# EasyEDA Pro project AT32M412_EVB_V0.3.eprj, schematic Schematic1

## Sheets
1 PWR: Board Name: AT32M412_EVB_V0.2; Create Date: 2025-06-04; Page Name: PWR; Project Name: AT32M412_EVB_V0.3; Schematic Name: Schematic1; Update Date: 2025-12-16; Company: 嘉立创EDA; Page Size: A4; Version: V1.0
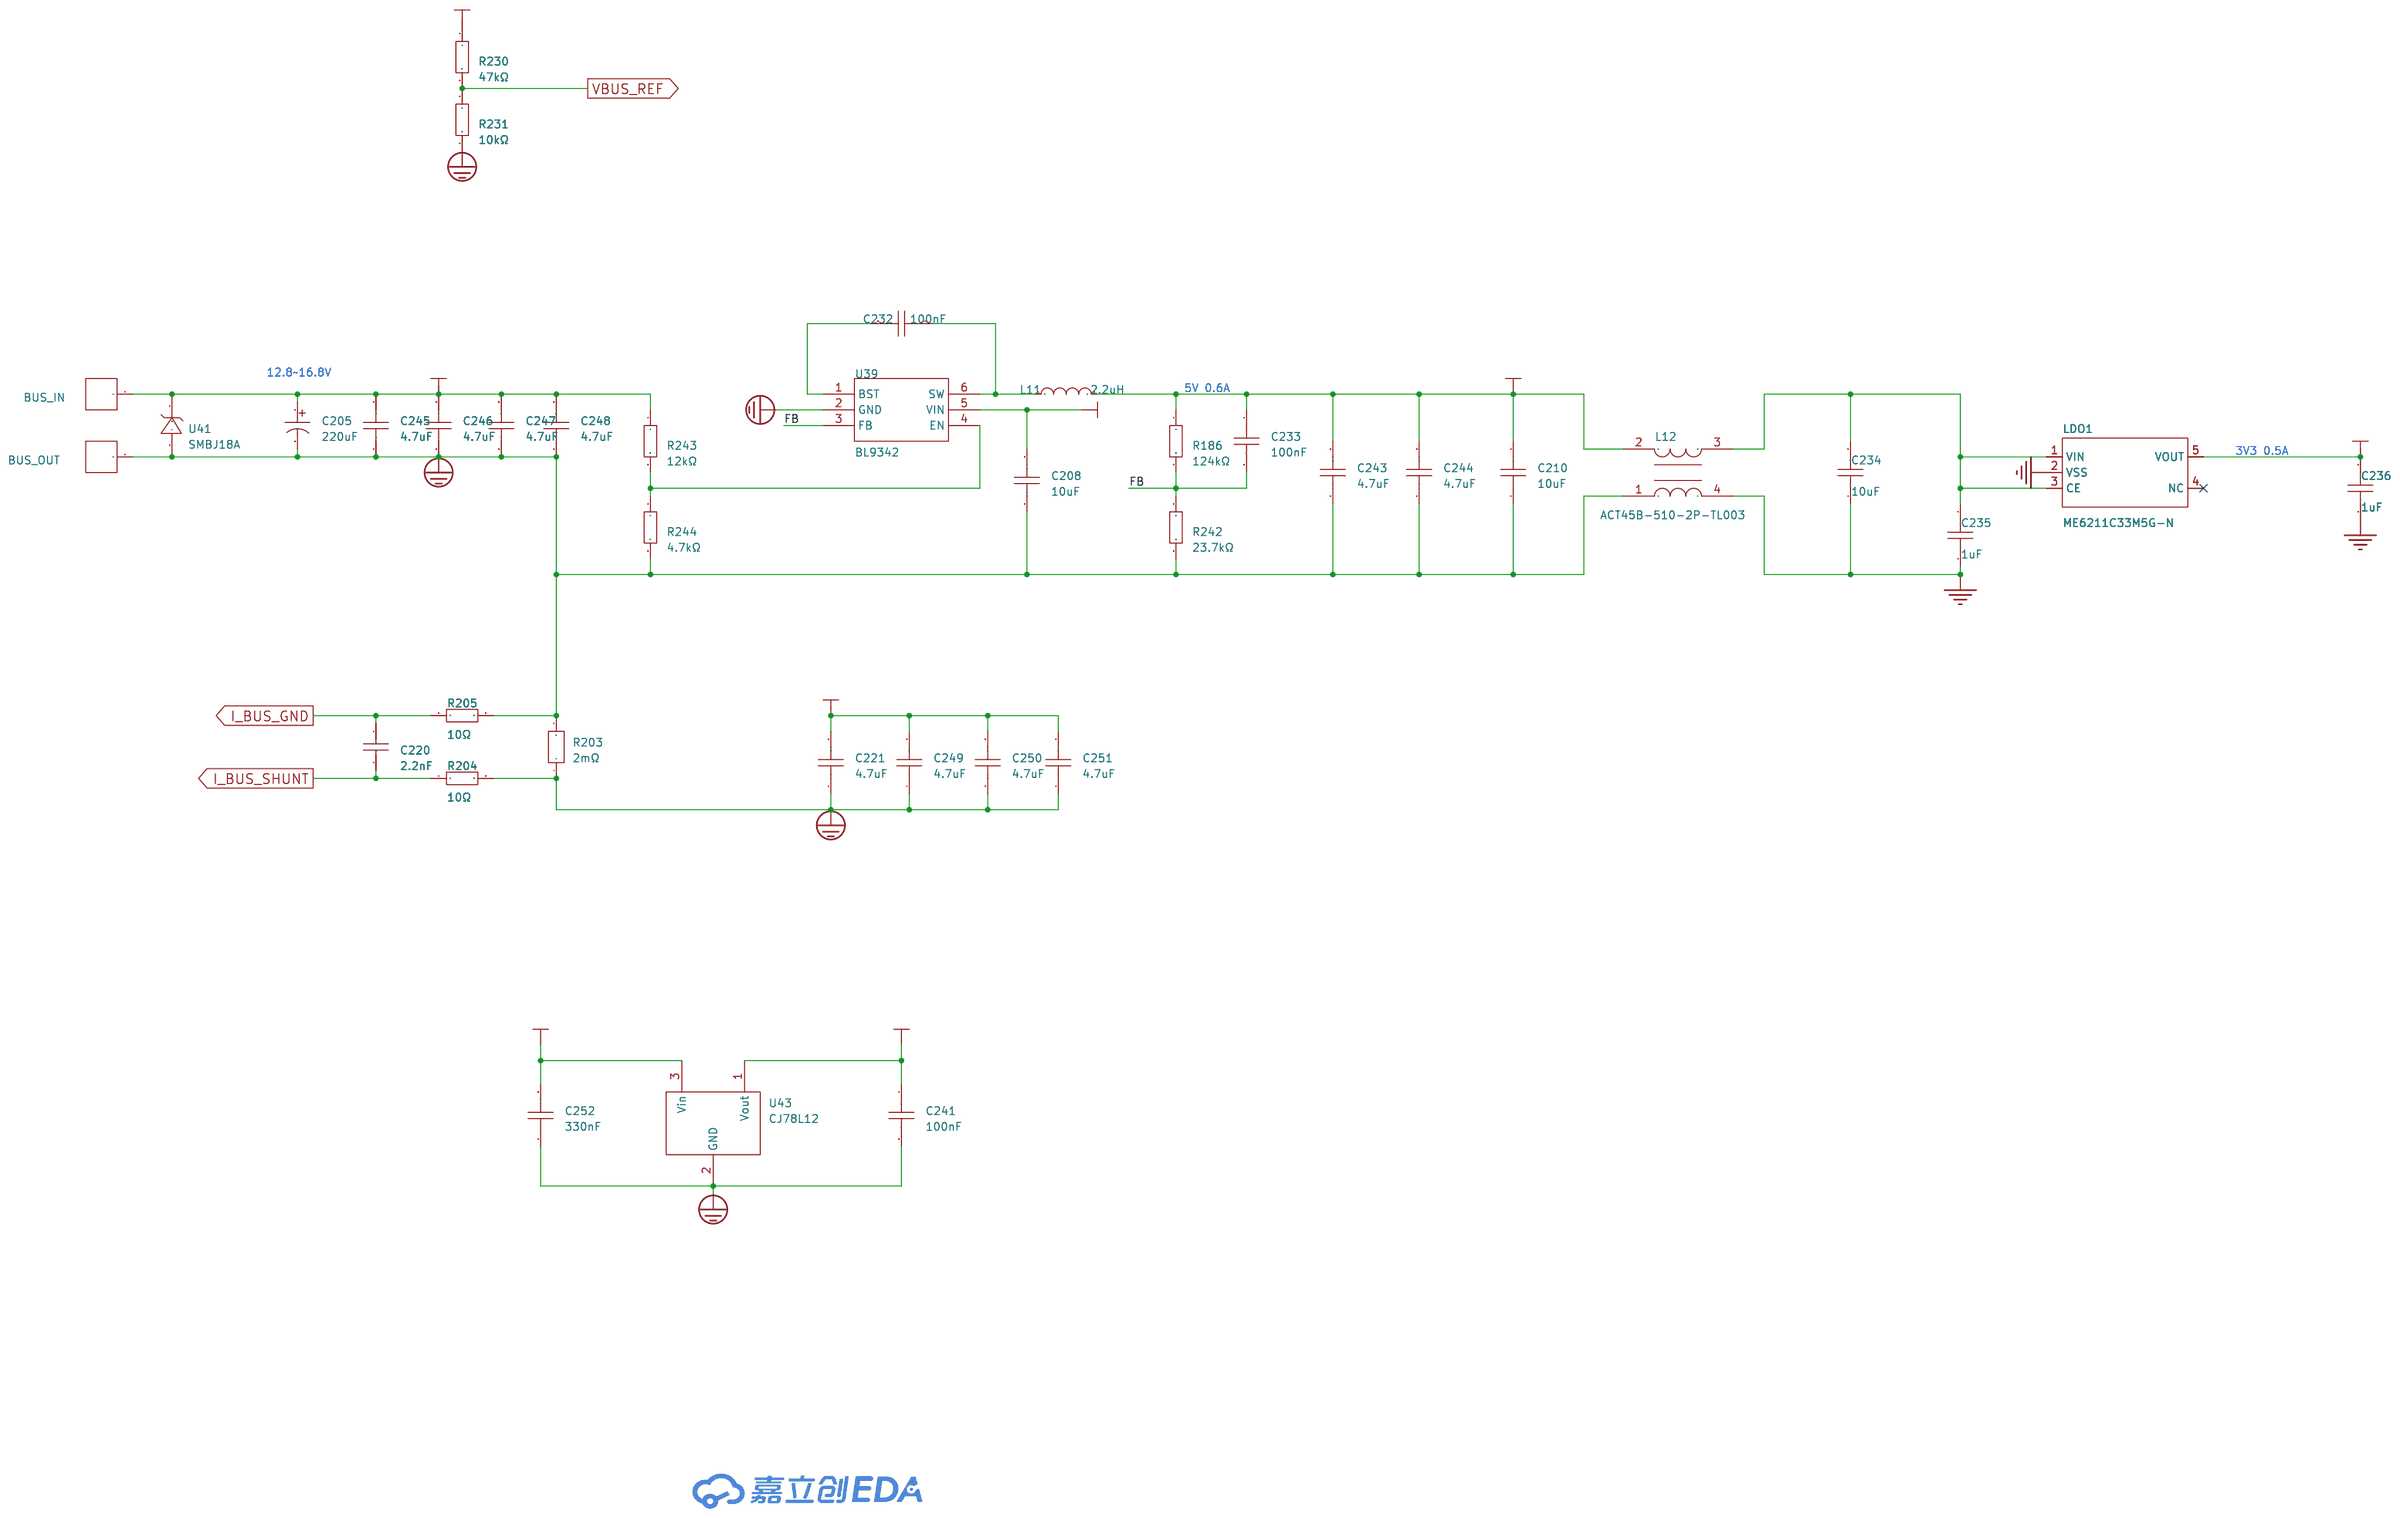
[diagram p0: PWR]
2 MCU: Page Name: MCU; Update Date: 2025-12-15
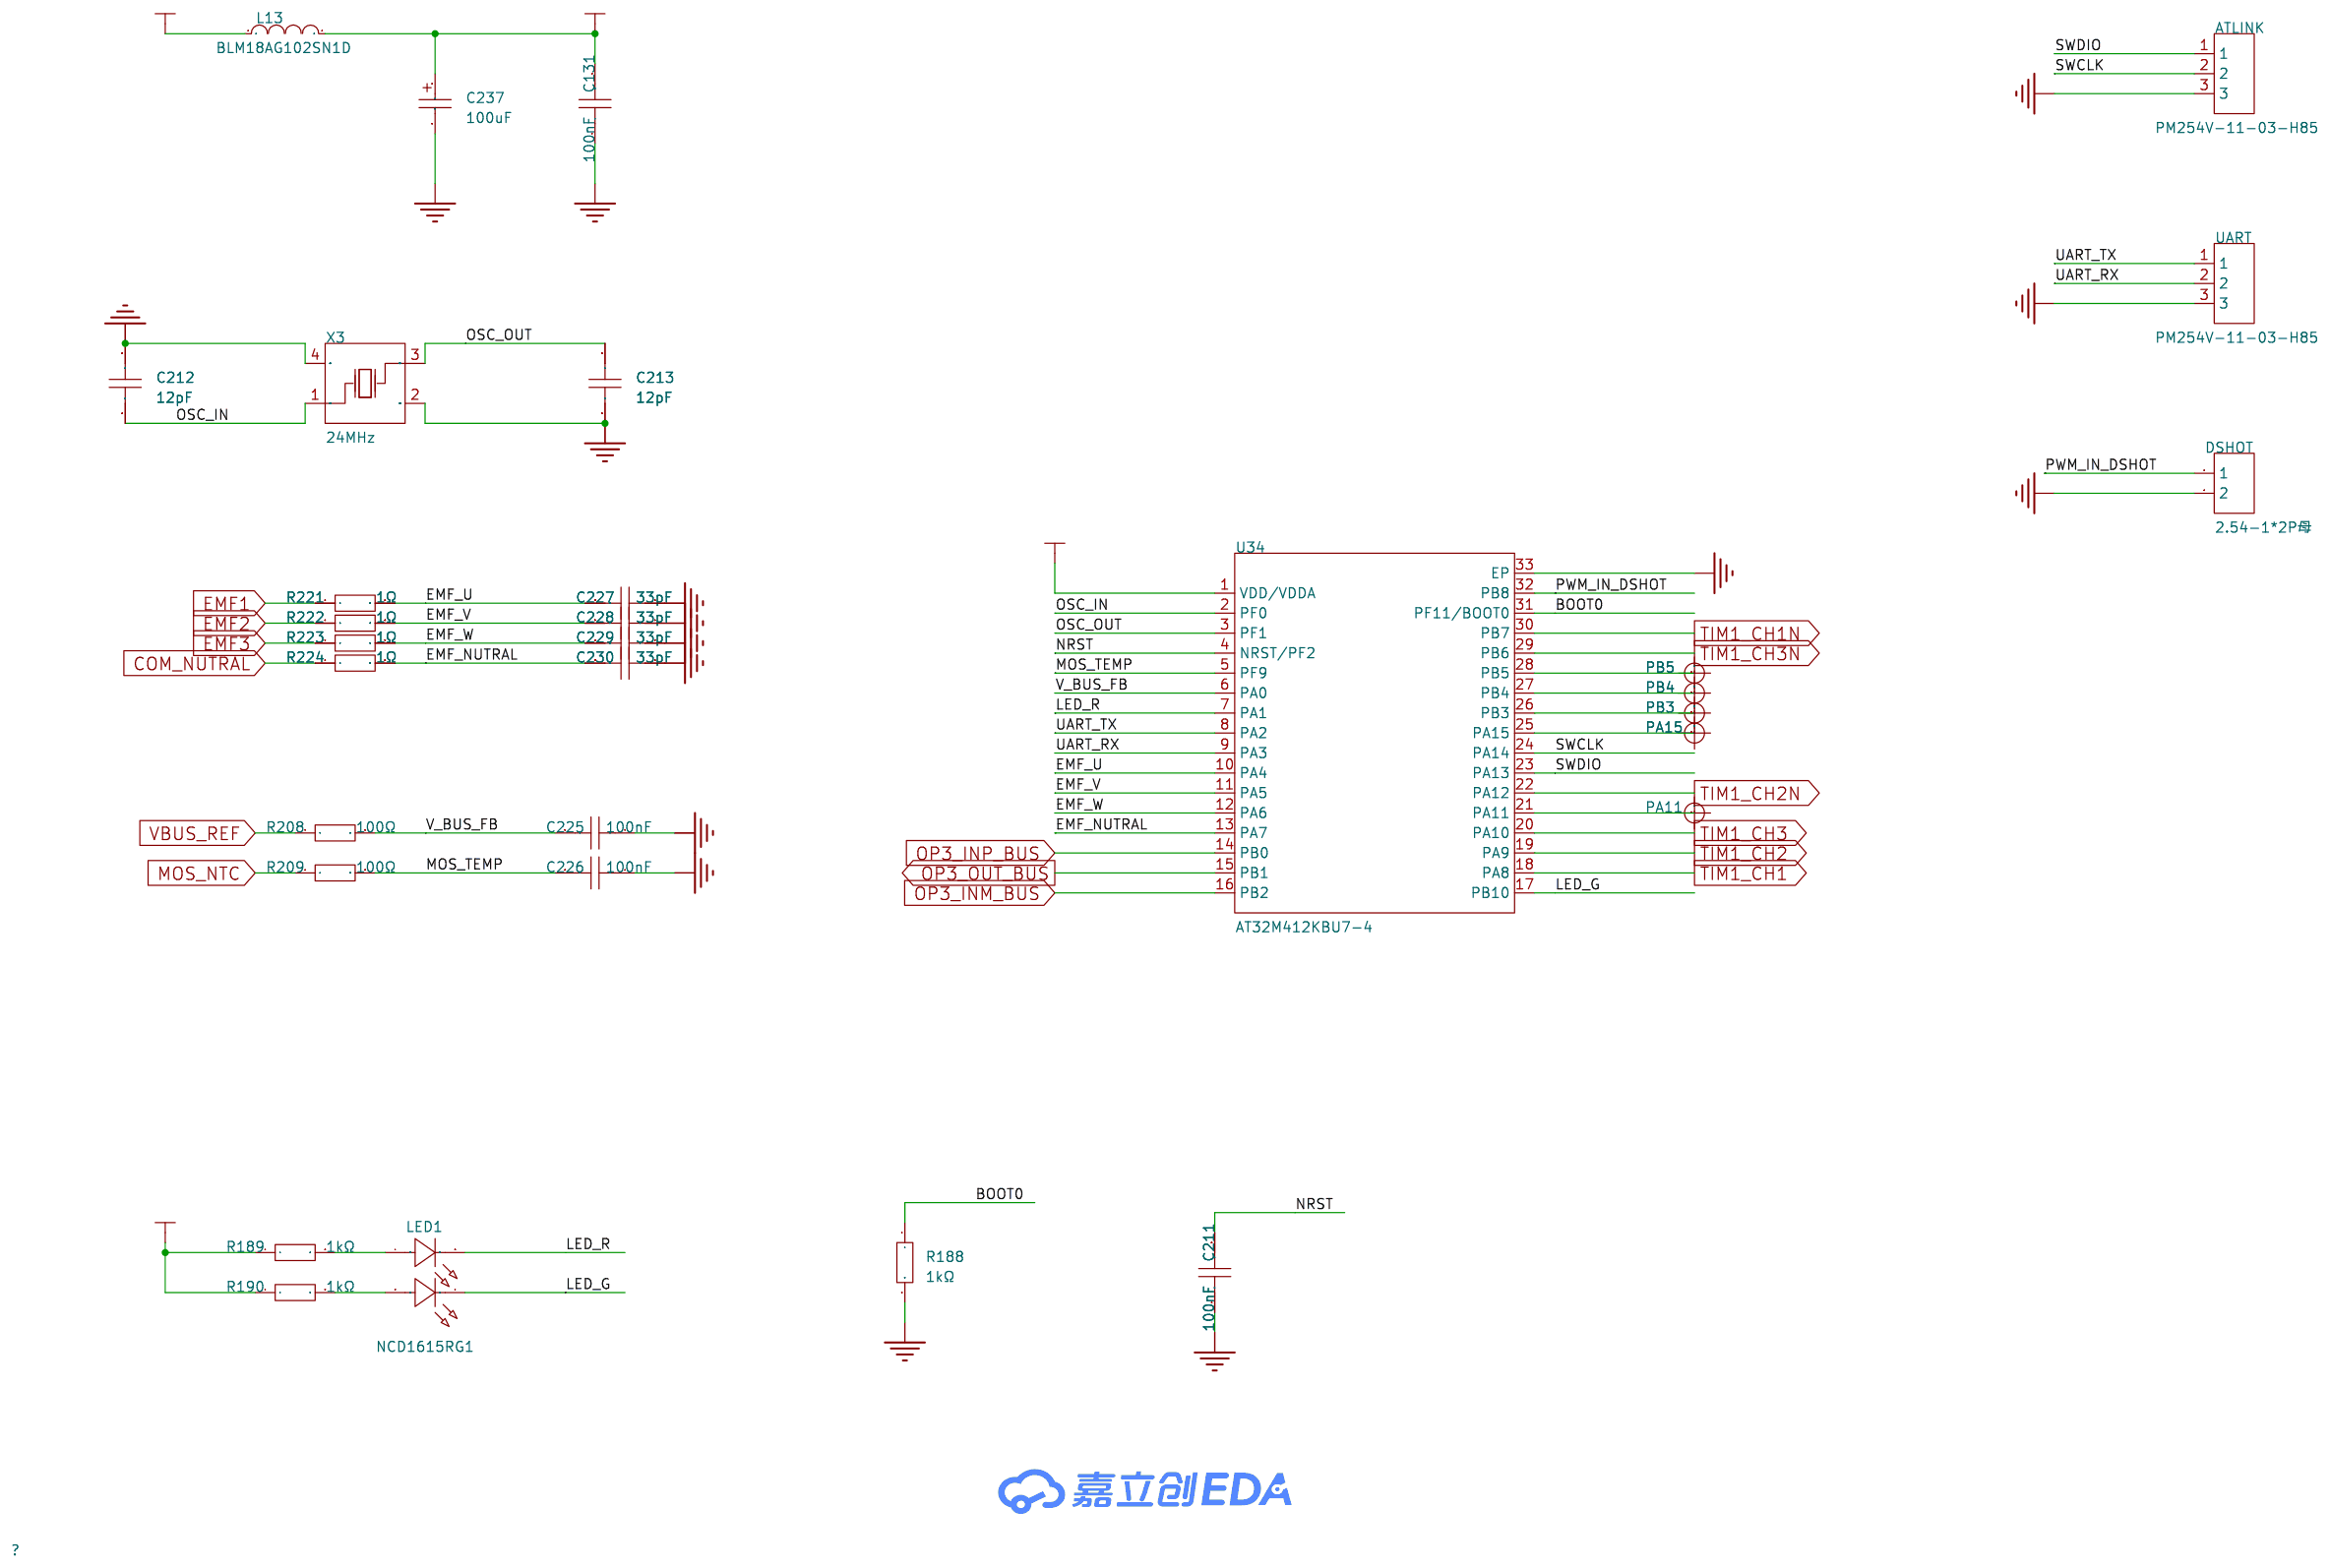
[diagram p1: MCU]
3 Driver: Create Date: 2025-10-28; Page Name: Driver; Update Date: 2025-12-15
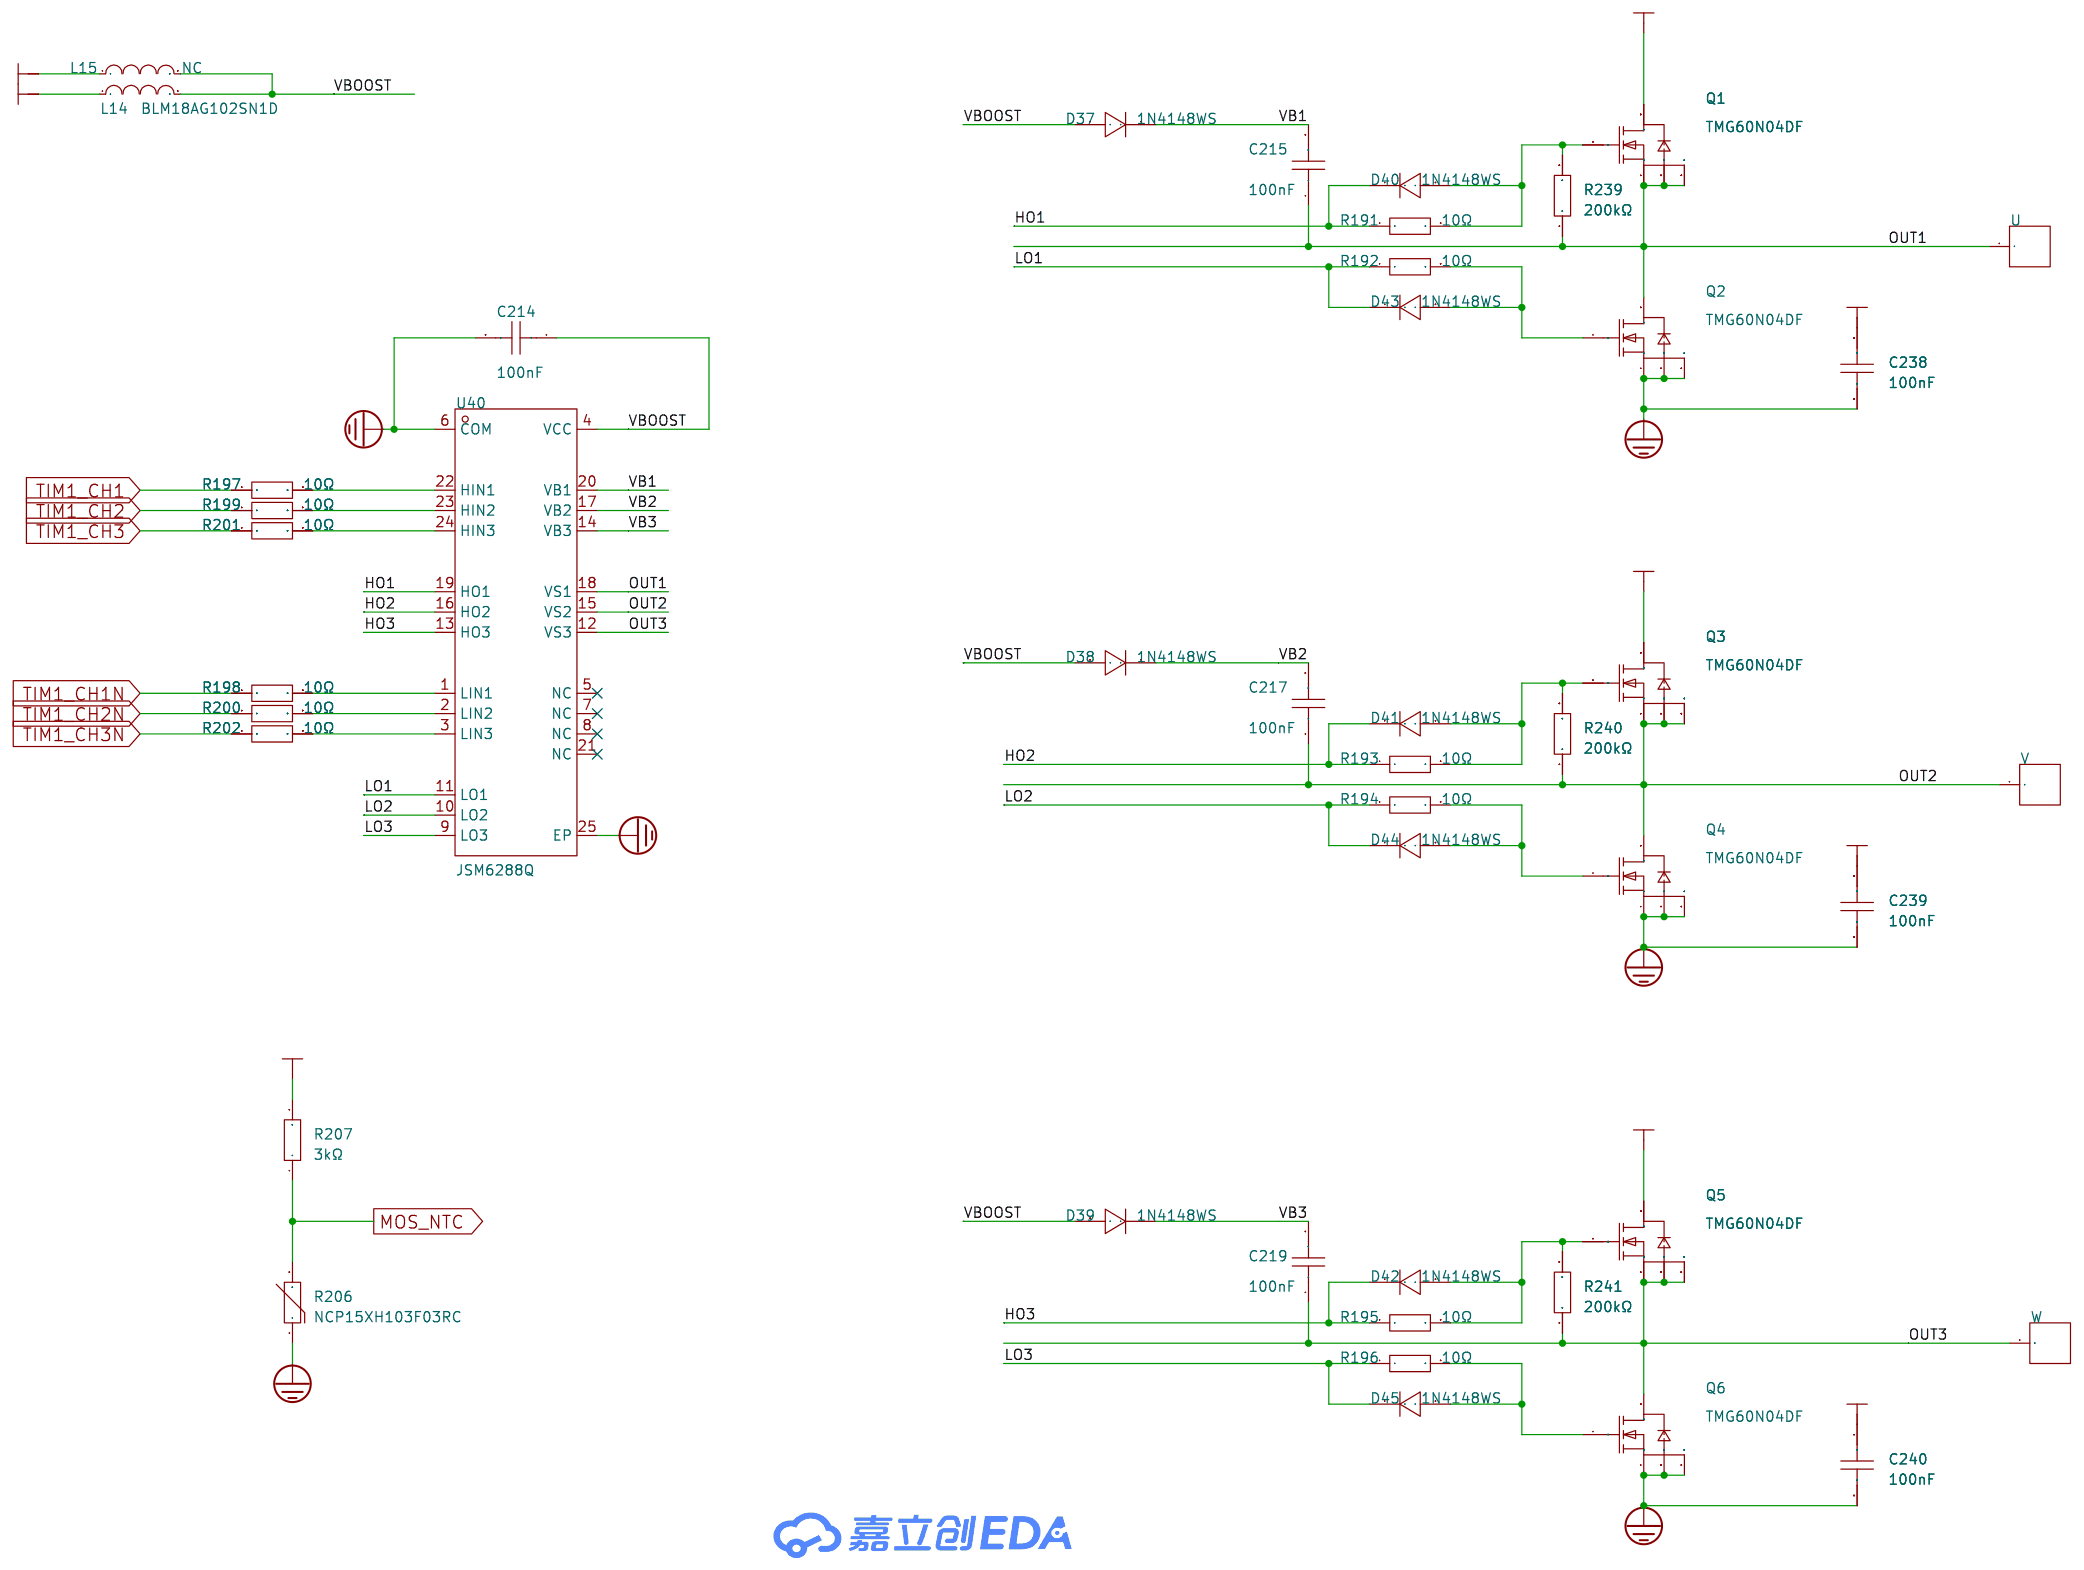
[diagram p2: Driver]
4 Sensing: Create Date: 2025-10-29; Page Name: Sensing; Update Date: 2025-11-24
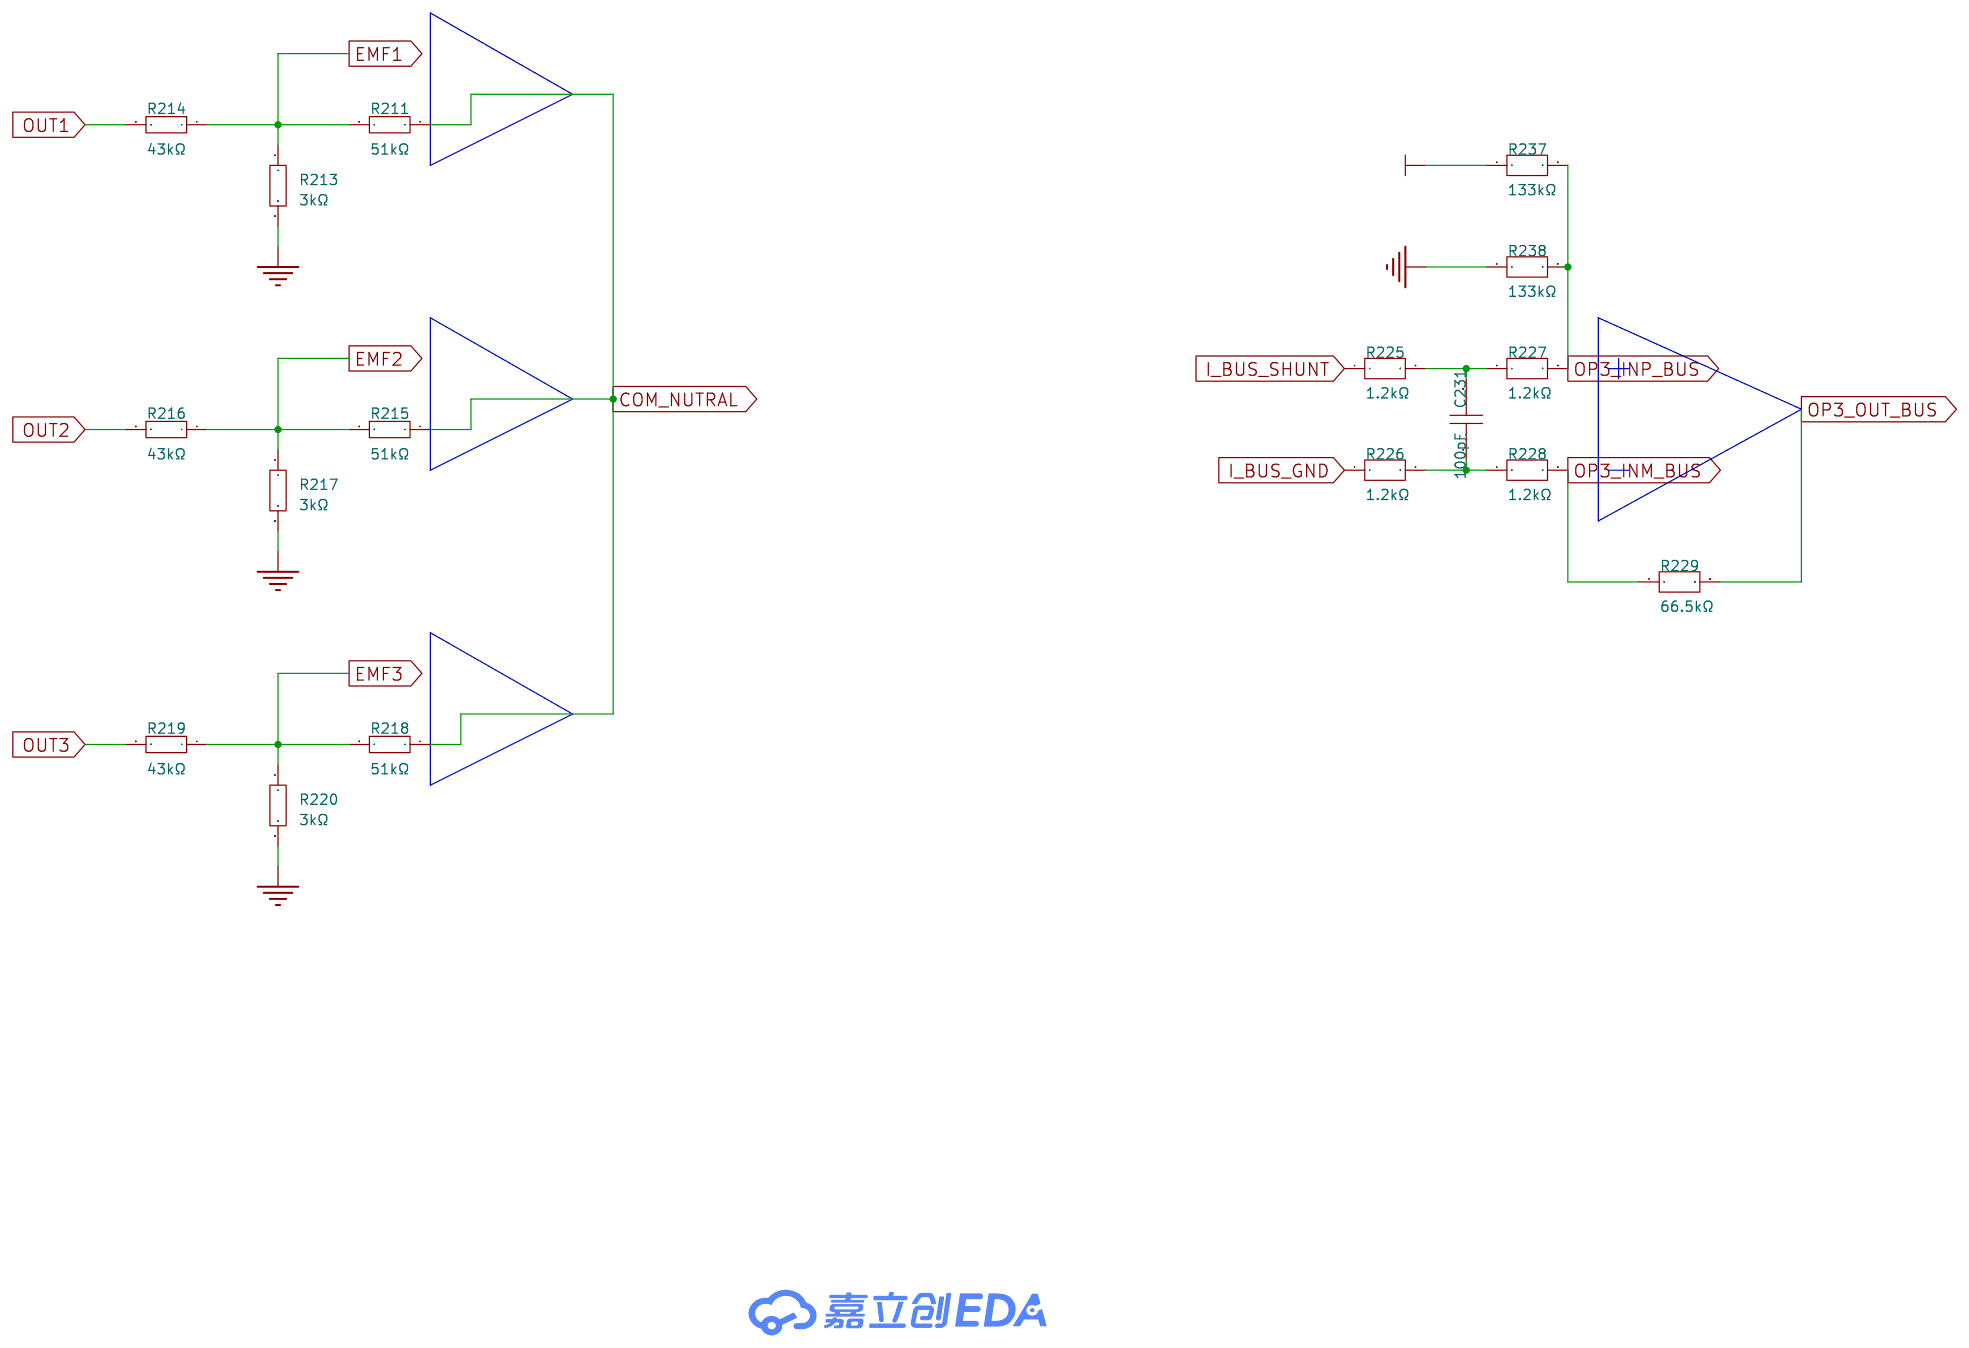
[diagram p3: Sensing]

## Parts
sheet Driver
C214  100nF  [C0402]
C215  100nF  [C0402]
C217  100nF  [C0402]
C219  100nF  [C0402]
C238  100nF  [C0402]
C239  100nF  [C0402]
C240  100nF  [C0402]
D37  1N4148WS  [SOD-323_L1.8-W1.3-LS2.5-RD]
D38  1N4148WS  [SOD-323_L1.8-W1.3-LS2.5-RD]
D39  1N4148WS  [SOD-323_L1.8-W1.3-LS2.5-RD]
D40  1N4148WS  [SOD-323_L1.8-W1.3-LS2.5-RD]
D41  1N4148WS  [SOD-323_L1.8-W1.3-LS2.5-RD]
D42  1N4148WS  [SOD-323_L1.8-W1.3-LS2.5-RD]
D43  1N4148WS  [SOD-323_L1.8-W1.3-LS2.5-RD]
D44  1N4148WS  [SOD-323_L1.8-W1.3-LS2.5-RD]
D45  1N4148WS  [SOD-323_L1.8-W1.3-LS2.5-RD]
L14  BLM18AG102SN1D  [L0603]
L15  NC  [L0603]
Q1  TMG60N04DF  [POWERDI3333-8_DMN7022LFGQ-7]
Q2  TMG60N04DF  [POWERDI3333-8_DMN7022LFGQ-7]
Q3  TMG60N04DF  [POWERDI3333-8_DMN7022LFGQ-7]
Q4  TMG60N04DF  [POWERDI3333-8_DMN7022LFGQ-7]
Q5  TMG60N04DF  [POWERDI3333-8_DMN7022LFGQ-7]
Q6  TMG60N04DF  [POWERDI3333-8_DMN7022LFGQ-7]
R191  10Ω  [R0402]
R192  10Ω  [R0402]
R193  10Ω  [R0402]
R194  10Ω  [R0402]
R195  10Ω  [R0402]
R196  10Ω  [R0402]
R197  10Ω  [R0402]
R198  10Ω  [R0402]
R199  10Ω  [R0402]
R200  10Ω  [R0402]
R201  10Ω  [R0402]
R202  10Ω  [R0402]
R206  NCP15XH103F03RC  [R0402]
R207  3kΩ  [R0402]
R239  200kΩ  [R0402]
R240  200kΩ  [R0402]
R241  200kΩ  [R0402]
U  -  [PAD_35A]
U40  JSM6288Q  [VQFN-24_L4.0-W4.0-P0.50-TL-EP2.7]
V  -  [PAD_35A]
W  -  [PAD_35A]
sheet MCU
ATLINK  PM254V-11-03-H85  [HDR-TH_3P-P2.54-V-F]
C131  100nF  [C0402]
C211  100nF  [C0402]
C212  12pF  [C0402]
C213  12pF  [C0402]
C225  100nF  [C0402]
C226  100nF  [C0402]
C227  33pF  [C0402]
C228  33pF  [C0402]
C229  33pF  [C0402]
C230  33pF  [C0402]
C237  100uF  [CASE-B_3528]
DSHOT  2.54-1*2P母  [HDR-TH_2P-P2.54-V-F]
L13  BLM18AG102SN1D  [L0603]
LED1  NCD1615RG1  [LED-SMD_4P-L1.6-W1.5-TL-1]
PA11  -  [Mark-Point-1mm]  (no BOM)
PA15  -  [Mark-Point-1mm]  (no BOM)
PB3  -  [Mark-Point-1mm]  (no BOM)
PB4  -  [Mark-Point-1mm]  (no BOM)
PB5  -  [Mark-Point-1mm]  (no BOM)
R188  1kΩ  [R0402]
R189  1kΩ  [R0402]
R190  1kΩ  [R0402]
R208  100Ω  [R0402]
R209  100Ω  [R0402]
R221  1Ω  [R0402]
R222  1Ω  [R0402]
R223  1Ω  [R0402]
R224  1Ω  [R0402]
U34  AT32M412KBU7-4  [WQFN-32_L4.0-W4.0-P0.40-TL-EP2.7]
UART  PM254V-11-03-H85  [HDR-TH_3P-P2.54-V-F]
X3  24MHz  [CRYSTAL-SMD_4P-L3.2-W2.5-BL]
sheet PWR
BUS_IN  -  [PAD_35A]
BUS_OUT  -  [PAD_35A]
C205  220uF  [CAP-TH_BD8.0-P3.50-D0.6-FD]
C208  10uF  [C0805]
C210  10uF  [C0402]
C220  2.2nF  [C0402]
C221  4.7uF  [C1210]
C232  100nF  [C0402]
C233  100nF  [C0402]
C234  10uF  [C0402]
C235  1uF  [C0402]
C236  1uF  [C0402]
C241  100nF  [C0402]
C243  4.7uF  [C0805]
C244  4.7uF  [C0805]
C245  4.7uF  [C1210]
C246  4.7uF  [C1210]
C247  4.7uF  [C1210]
C248  4.7uF  [C1210]
C249  4.7uF  [C1210]
C250  4.7uF  [C1210]
C251  4.7uF  [C1210]
C252  330nF  [C0805]
L11  2.2uH  [IND-SMD_L2.5-W2.0_MHCHL2520]
L12  ACT45B-510-2P-TL003  [IND-SMD_4P-L4.5-W3.2-TL]
LDO1  ME6211C33M5G-N  [SOT-23-5_L3.0-W1.7-P0.95-LS2.8-BL]
R186  124kΩ  [R0402]
R203  2mΩ  [RES-SMD_L6.4-W3.2-1]
R204  10Ω  [R0402]
R205  10Ω  [R0402]
R230  47kΩ  [R0402]
R231  10kΩ  [R0402]
R242  23.7kΩ  [R0402]
R243  12kΩ  [R0402]
R244  4.7kΩ  [R0402]
U39  BL9342  [SOT-23-6_L2.9-W1.6-P0.95-LS2.8-BL]
U41  SMBJ18A  [SMB_L4.5-W3.6-LS5.4-RD]
U43  CJ78L12  [SOT-89-3_L4.5-W2.5-P1.50-LS4.2-BR]
sheet Sensing
C231  100pF  [C0402]
R211  51kΩ  [R0402]
R213  3kΩ  [R0402]
R214  43kΩ  [R0402]
R215  51kΩ  [R0402]
R216  43kΩ  [R0402]
R217  3kΩ  [R0402]
R218  51kΩ  [R0402]
R219  43kΩ  [R0402]
R220  3kΩ  [R0402]
R225  1.2kΩ  [R0402]
R226  1.2kΩ  [R0402]
R227  1.2kΩ  [R0402]
R228  1.2kΩ  [R0402]
R229  66.5kΩ  [R0402]
R237  133kΩ  [R0402]
R238  133kΩ  [R0402]

## Library data of the parts
C214 C215 C217 C219 C238-C240 = CL05B104KB54PNC: LCSC Part Name: 100nF ±10% 50V; Supplier Part: C307331; Manufacturer: SAMSUNG(三星); Supplier Footprint: 0402; JLCPCB Part Class: 基础库; Datasheet: https://item.szlcsc.com/datasheet/CL05B104KB54PNC/291005.html; Supplier: LCSC; Tolerance: ±10%; Voltage Rating: 50V; Temperature Coefficient: X7R
D37-D45 = 1N4148WS_C2128: LCSC Part Name: 丝印T4 1N4148WS; Supplier Part: C2128; Manufacturer: CJ(江苏长电/长晶); Supplier Footprint: SOD-323; JLCPCB Part Class: 基础库; Datasheet: https://atta.szlcsc.com/upload/public/pdf/source/20140809/1457707208178.pdf; Supplier: LCSC; Diode Configuration: 独立式; Voltage - Forward(Vf@If): 1.25V@150mA; Voltage - DC Reverse(Vr): 100V; Current - Rectified: 150mA; Reverse Leakage Current (Ir): 1uA@75V; Reverse Recovery Time (trr): 4ns
L13 L14 = BLM18AG102SN1D: LCSC Part Name: 单路 0603磁珠 阻抗1kΩ@100MHz; Supplier Part: C85824; Manufacturer: muRata(村田); Supplier Footprint: 0603; JLCPCB Part Class: 扩展库; Datasheet: https://atta.szlcsc.com/upload/public/pdf/source/20180329/C160981_FD3C2D2622A377E203B89F4AA32B0741.pdf; Supplier: LCSC; Impedance @ Frequency: 1kΩ@100MHz; Tolerance: ±25%; DC Resistance: 500mΩ; Current Rating: 450mA; Circuits: 1
L15 = BLM18AG102SN1D: LCSC Part Name: 单路 0603磁珠 阻抗1kΩ@100MHz; Supplier Part: C85824; Manufacturer: muRata(村田); Supplier Footprint: 0603; JLCPCB Part Class: 扩展库; Datasheet: https://atta.szlcsc.com/upload/public/pdf/source/20180329/C160981_FD3C2D2622A377E203B89F4AA32B0741.pdf; Supplier: LCSC; Impedance @ Frequency: 1kΩ@100MHz; Tolerance: ±25%; DC Resistance: 500mΩ; Current Rating: 450mA; Circuits: 1; Check: false
Q1-Q6 = TMG60N04DF: LCSC Part Name: 1个N沟道 耐压:40V 电流:60A; Supplier Part: C7422898; Manufacturer: TMC(台懋); Supplier Footprint: PDFN3x3-8L; JLCPCB Part Class: 扩展库; Datasheet: https://item.szlcsc.com/datasheet/TMG60N04DF/8406147.html; Supplier: LCSC; Number: 1个N沟道; Drain to Source Voltage: 40V; Current - Continuous Drain(Id): 60A; RDS(on): 6.9mΩ@10V; Gate Threshold Voltage (Vgs(th)): 1.7V@250uA; Gate Charge(Qg): 5.8nC@4.5V; Input Capacitance(Ciss): 1.69nF; Reverse Transfer Capacitance (Crss@Vds): 38pF; Operating Temperature: -55℃~+150℃; Type: N沟道; Output Capacitance(Coss): 193pF
R191-R202 R204 R205 = 0402WGF100JTCE: 电阻类型:厚膜电阻;阻值:10Ω;精度:±1%;功率:62.5mW;工作电压:50V;温度系数:±200ppm/℃;; LCSC Part Name: 10Ω ±1% 62.5mW 厚膜电阻; Supplier Part: C25077; Manufacturer: UNI-ROYAL(厚声); Supplier Footprint: 0402; JLCPCB Part Class: Basic Part; Datasheet: https://item.szlcsc.com/datasheet/0402WGF100JTCE/25820.html; Supplier: LCSC; Type: 厚膜电阻; Tolerance: ±1%; Power(Watts): 62.5mW; Overload Voltage (Max): 50V; Temperature Coefficient: ±200ppm/℃; Operating Temperature Range: -55℃~+155℃; Voltage-Supply(Max): 50V; Operating Temperature: -55℃~+155℃
R206 = NCP15XH103F03RC: LCSC Part Name: 10kΩ 3380K 100mW; Supplier Part: C77131; Manufacturer: muRata(村田); Supplier Footprint: 0402; JLCPCB Part Class: 扩展库; Datasheet: https://item.szlcsc.com/datasheet/NCP15XH103F03RC/78258.html; Supplier: LCSC; Resistance @ 25℃: 10kΩ; B Constant (25℃/50℃): 3380K; Resistance Tolerance: ±1%; B Constant (25℃/85℃): 3434K; B Constant (25℃/100℃): 3455K; Power(Watts): 100mW; B Constant Tolerance: ±1%; Steady State Current (Max): 310uA; Operating Temperature: -40℃~+125℃; Dissipation Factor: 1mW/℃; Length: 1mm; Width: 0.5mm
R207 = 0402WGF3001TCE: LCSC Part Name: 3kΩ ±1% 62.5mW 厚膜电阻; Supplier Part: C25784; Manufacturer: UNI-ROYAL(厚声); Supplier Footprint: 0402; JLCPCB Part Class: Extended Part; Datasheet: https://atta.szlcsc.com/upload/public/pdf/source/20200306/C422600_1E6D84923E4A46A82E41ADD87F860B5C.pdf; Supplier: LCSC; Type: 厚膜电阻; Tolerance: ±1%; Power(Watts): 62.5mW; Overload Voltage (Max): 50V; Temperature Coefficient: ±100ppm/℃; Operating Temperature Range: -55℃~+155℃
R239-R241 = 0402WGF2003TCE: LCSC Part Name: 200kΩ ±1% 62.5mW 厚膜电阻; Supplier Part: C25764; Manufacturer: UNI-ROYAL(厚声); Supplier Footprint: 0402; JLCPCB Part Class: Basic Part; Datasheet: https://item.szlcsc.com/datasheet/0402WGF2003TCE/26507.html; Supplier: LCSC; Type: 厚膜电阻; Tolerance: ±1%; Power(Watts): 62.5mW; Voltage-Supply(Max): 50V; Temperature Coefficient: ±100ppm/℃; Operating Temperature: -55℃~+155℃
BUS_IN BUS_OUT U V W = PAD_35A: Supplier Footprint: 插件; Check: false
U40 = JSM6288Q: LCSC Part Name: 250V三相高低侧功率驱动芯片 高低侧同相 步进/伺服电机、电动工具等兼容FD6288Q.; Supplier Part: C19077370; Manufacturer: JSMSEMI(杰盛微); Supplier Footprint: QFN-24; JLCPCB Part Class: 扩展库; Datasheet: https://item.szlcsc.com/datasheet/JSM6288Q/20275147.html; Supplier: LCSC; Load Type: MOSFET; Current - Output Low(IOL): 1.8A; Current - Output High(IOH): 1.5A; Voltage - Supply: 8V~20V; Fall Time: 30ns; Operating Temperature: -40℃~+125℃
ATLINK UART = PM254V-11-03-H85: LCSC Part Name: 1x3P 间距:2.54mm 直插; Supplier Part: C541850; Manufacturer: XFCN(兴飞); Supplier Footprint: 插件,P=2.54mm; JLCPCB Part Class: Extended Part; Datasheet: https://item.szlcsc.com/datasheet/PM254V-11-03-H85/562471.html; Supplier: LCSC; Holes Structure: 1x3P; Pitch: 2.54mm; Circular Hole / Square Hole: 方孔; Mounting Type: 直插; Number of Rows: 单排; Number of Positions: 3P; Current Rating: 3A; Holes Direction: 顶部; Insulation Height: 8.5mm; Contact Material: 黄铜; Operating Temperature: -40℃~+105℃
C131 C211 C225 C226 C232 C233 C241 = CL05B104KO5NNNC: 容值:100nF;精度:±10%;额定电压:16V;材质(温度系数):X7R;; LCSC Part Name: 100nF ±10% 16V; Supplier Part: C1525; Manufacturer: SAMSUNG(三星); Supplier Footprint: 0402; JLCPCB Part Class: Basic Part; Datasheet: https://atta.szlcsc.com/upload/public/pdf/source/20160218/1457707763339.pdf; Supplier: LCSC; Tolerance: ±10%; Voltage Rated: 16V; Temperature Coefficient: X7R
C212 C213 = 0402CG120J500NT: LCSC Part Name: 12pF ±5% 50V; Supplier Part: C1547; Manufacturer: FH(风华); Supplier Footprint: 0402; JLCPCB Part Class: Basic Part; Datasheet: https://item.szlcsc.com/datasheet/0402CG120J500NT/1899.html; Supplier: LCSC; Tolerance: ±5%; Voltage Rating: 50V; Temperature Coefficient: C0G
C227-C230 = 0402CG330J500NT: LCSC Part Name: 33pF ±5% 50V; Supplier Part: C1562; Manufacturer: FH(风华); Supplier Footprint: 0402; JLCPCB Part Class: Basic Part; Datasheet: https://item.szlcsc.com/datasheet/0402CG330J500NT/1914.html; Supplier: LCSC; Tolerance: ±5%; Voltage Rating: 50V; Temperature Coefficient: C0G
C237 = TAJB107K006RNJ: 容值:100uF;精度:±10%;额定电压:6.3V;等效串联电阻:1.7Ω@100kHz;; LCSC Part Name: 100uF ±10% 6.3V; Supplier Part: C16133; Manufacturer: Kyocera AVX; Supplier Footprint: CASE-B-3528-21(mm); JLCPCB Part Class: 基础库; Datasheet: https://atta.szlcsc.com/upload/public/pdf/source/20160107/1457707750344.pdf; Supplier: LCSC; Tolerance: ±10%; Rated Voltage: 6.3V; Equivalent Series Resistance(ESR): 1.7Ω@100kHz; Operating Temperature: -55℃~+125℃
DSHOT = 2.54-1*2P母: LCSC Part Name: 1x2P 间距:2.54mm 直插; Supplier Part: C49661; Manufacturer: BOOMELE(博穆精密); Supplier Footprint: 插件,P=2.54mm; JLCPCB Part Class: Extended Part; Datasheet: https://item.szlcsc.com/datasheet/2.54-1*2P%25E6%25AF%258D/50669.html; Supplier: LCSC; Holes Structure: 1x2P; Pitch: 2.54mm; Circular Hole / Square Hole: 方孔; Mounting Type: 直插; Number of Rows: 单排; Number of Positions: 2P; Current Rating: 3A; Holes Direction: 顶部; Insulation Height: 3.3mm; Operating Temperature: -40℃~+105℃
LED1 = NCD1615RG1: LCSC Part Name: 片式发光二极管; Supplier Part: C2917181; Manufacturer: 国星光电; Supplier Footprint: SMD-4P,1.6x1.5mm; JLCPCB Part Class: 扩展库; Datasheet: https://item.szlcsc.com/datasheet/NCD1615RG1/3215920.html; Supplier: LCSC; Illumination Color: 橙红色,翠绿色; Voltage - Forward(Vf): 3.2V；2V; Power(Watts): 72mW；52mW; Forward Current: 20mA; Wavelength - Dominant: 625nm；525nm; Luminous Intensity: 260mcd；150mcd; Viewing Angle: 130°; Operating Temperature: -30℃~+85℃
PA11 PA15 PB3-PB5 = Mark-Point: Mark点
R188-R190 = 0402WGF1001TCE: 电阻类型:厚膜电阻;阻值:1kΩ;精度:±1%;功率:62.5mW;工作电压:50V;温度系数:±100ppm/℃;; LCSC Part Name: 1kΩ ±1% 62.5mW 厚膜电阻; Supplier Part: C11702; Manufacturer: UNI-ROYAL(厚声); Supplier Footprint: 0402; JLCPCB Part Class: Basic Part; Datasheet: https://item.szlcsc.com/datasheet/0402WGF1001TCE/12256.html; Supplier: LCSC; Type: 厚膜电阻; Tolerance: ±1%; Power(Watts): 62.5mW; Overload Voltage (Max): 50V; Temperature Coefficient: ±100ppm/℃; Operating Temperature Range: -55℃~+155℃; Voltage-Supply(Max): 50V; Operating Temperature: -55℃~+155℃
R208 R209 = 0402WGF1000TCE: LCSC Part Name: 100Ω ±1% 62.5mW 厚膜电阻; Supplier Part: C25076; Manufacturer: UNI-ROYAL(厚声); Supplier Footprint: 0402; JLCPCB Part Class: Basic Part; Datasheet: https://atta.szlcsc.com/upload/public/pdf/source/20200306/C422600_1E6D84923E4A46A82E41ADD87F860B5C.pdf; Supplier: LCSC; Type: 厚膜电阻; Tolerance: ±1%; Power(Watts): 62.5mW; Overload Voltage (Max): 50V; Temperature Coefficient: ±200ppm/℃; Operating Temperature Range: -55℃~+155℃
R221-R224 = 0402WGF100KTCE: LCSC Part Name: 1Ω ±1% 62.5mW 厚膜电阻; Supplier Part: C25086; Manufacturer: UNI-ROYAL(厚声); Supplier Footprint: 0402; JLCPCB Part Class: Extended Part; Datasheet: https://item.szlcsc.com/datasheet/0402WGF100KTCE/25829.html; Supplier: LCSC; Type: 厚膜电阻; Tolerance: ±1%; Power(Watts): 62.5mW; Voltage-Supply(Max): 50V; Temperature Coefficient: ±200ppm/℃; Operating Temperature: -55℃~+155℃
U34 = AT32M412KBU7-4: Supplier Part: C42410968; Manufacturer: ARTERY(雅特力); Supplier Footprint: QFN-32_4x4mm; JLCPCB Part Class: 扩展库; Datasheet: https://atta.szlcsc.com/upload/public/pdf/source/20250710/275EB83BD9923F6F1F7FFA3B8998FAE1.pdf; Supplier: LCSC
X3 = X322524MOB4SI: LCSC Part Name: YSX321SL 24MHZ 4P 3225 12PF ±10PPM -40~85℃ (±20PPM); Supplier Part: C70590; Manufacturer: YXC(扬兴晶振); Supplier Footprint: SMD3225-4P; JLCPCB Part Class: 扩展库; Datasheet: https://item.szlcsc.com/datasheet/X322524MOB4SI/71688.html; Supplier: LCSC; Type: 贴片晶振; Normal temperature Frequency Tolerance: ±10ppm; Load Capacitance: 12pF; Frequency Stability: ±20ppm; Operating Temperature: -40℃~+85℃
C205 = ERS1VM221F12OT: LCSC Part Name: 220uF ±20% 35V; Supplier Part: C106697; Manufacturer: AISHI(艾华集团); Supplier Footprint: 插件,D8xL12mm; JLCPCB Part Class: 扩展库; Datasheet: https://atta.szlcsc.com/upload/public/pdf/source/20191015/C438940_4B8E60A742BB0AE40DDEF87A5C89089D.pdf; Supplier: LCSC; Tolerance: ±20%; Rated Voltage: 35V; Lead Spacing: 3.5mm; φD: 8mm; L: 12mm; Lifetime @ Temp: 7000hrs@105℃
C208 = CL21A106KAYNNNE_C15850: LCSC Part Name: 10uF ±10% 25V; Supplier Part: C15850; Manufacturer: SAMSUNG(三星); Manufacturer Part: CL21A106KAYNNNE; Supplier Footprint: 0805; JLCPCB Part Class: 基础库; Datasheet: https://item.szlcsc.com/datasheet/CL21A106KAYNNNE/16532.html; Supplier: LCSC; Tolerance: ±10%; Voltage Rating: 25V; Temperature Coefficient: X5R
C210 C234 = CL05A106MQ5NUNC: 容值:10uF;精度:±20%;额定电压:6.3V;温度系数:X5R;; LCSC Part Name: 10uF ±20% 6.3V; Supplier Part: C15525; Manufacturer: SAMSUNG(三星); Supplier Footprint: 0402; JLCPCB Part Class: Basic Part; Datasheet: https://item.szlcsc.com/datasheet/CL05A106MQ5NUNC/16204.html; Supplier: LCSC; Tolerance: ±20%; Voltage Rated: 6.3V; Temperature Coefficient: X5R; Voltage Rating: 6.3V
C220 = 0402B222K500NT: LCSC Part Name: 2.2nF ±10% 50V; Supplier Part: C1531; Manufacturer: FH(风华); Supplier Footprint: 0402; JLCPCB Part Class: 扩展库; Datasheet: https://item.szlcsc.com/datasheet/0402B222K500NT/1883.html; Supplier: LCSC; Tolerance: ±10%; Voltage Rating: 50V; Temperature Coefficient: X7R
C221 C245-C251 = FS32X475K101EGG: LCSC Part Name: 4.7uF ±10% 100V; Supplier Part: C381466; Manufacturer: PSA(信昌电陶); Supplier Footprint: 1210; JLCPCB Part Class: 扩展库; Datasheet: https://item.szlcsc.com/datasheet/FS32X475K101EGG/354087.html; Supplier: LCSC; Tolerance: ±10%; Voltage Rating: 100V; Temperature Coefficient: X7R
C235 C236 = CL05A105KA5NQNC: 容值:1uF;精度:±10%;额定电压:25V;温度系数:X5R;; LCSC Part Name: 1uF ±10% 25V; Supplier Part: C52923; Manufacturer: SAMSUNG(三星); Supplier Footprint: 0402; JLCPCB Part Class: Basic Part; Datasheet: https://item.szlcsc.com/datasheet/CL05A105KA5NQNC/53938.html; Supplier: LCSC; Tolerance: ±10%; Voltage Rated: 25V; Temperature Coefficient: X5R; Voltage Rating: 25V
C243 C244 = 0805B475K500NT: LCSC Part Name: 4.7uF ±10% 50V; Supplier Part: C2991173; Manufacturer: FH(风华); Supplier Footprint: 0805; JLCPCB Part Class: 扩展库; Datasheet: https://item.szlcsc.com/datasheet/0805B475K500NT/3453339.html; Supplier: LCSC; Tolerance: ±10%; Voltage Rating: 50V; Temperature Coefficient: X7R
C252 = CC0805KKX7R0BB334: LCSC Part Name: 330nF ±10% 100V; Supplier Part: C7500383; Manufacturer: YAGEO(国巨); Supplier Footprint: 0805; JLCPCB Part Class: 扩展库; Datasheet: https://item.szlcsc.com/datasheet/CC0805KKX7R0BB334/8577181.html; Supplier: LCSC; Tolerance: ±10%; Voltage Rating: 100V; Temperature Coefficient: X7R
L11 = FTC252012S2R2MBCA: 电感值:2.2uH;精度:±20%;额定电流:3A;饱和电流(Isat):3.8A;类型:一体成型电感;; LCSC Part Name: 2.2uH ±20% 3.8A; Supplier Part: C5832372; Manufacturer: cjiang(长江微电); Supplier Footprint: 1008; JLCPCB Part Class: 扩展库; Datasheet: https://atta.szlcsc.com/upload/public/pdf/source/20230602/8FFEDA9C0247A92A0D4B67554BFE4091.pdf; Supplier: LCSC; Tolerance: ±20%; Rated Current: 3A; Saturation Current (Isat): 3.8A; DC Resistance (DCR): 55mΩ; Type: 一体成型电感
L12 = ACT45B-510-2P-TL003: LCSC Part Name: 两路 4532共模滤波器 阻抗2.8kΩ@10MHz; Supplier Part: C76584; Manufacturer: TDK; Supplier Footprint: SMD,4.5x3.2mm; JLCPCB Part Class: 扩展库; Datasheet: https://atta.szlcsc.com/upload/public/pdf/source/20160918/1474166842057.pdf; Supplier: LCSC; Number of Lines: 2; Withstanding Voltage: 250V@2secs; Current Rating: 200mA; Inductance @ Frequency: 51uH@100kHz; Voltage Rating - DC: 50V; Impedance @ Frequency: 2.8kΩ@10MHz; DC Resistance (DCR): 1Ω; Operating Temperature: -40℃~+150℃
LDO1 = ME6211C33M5G-N: LCSC Part Name: 输入6V 输出3.3V 500mA; Supplier Part: C82942; Manufacturer: MICRONE(南京微盟); Supplier Footprint: SOT-23-5; JLCPCB Part Class: 扩展库; Datasheet: https://atta.szlcsc.com/upload/public/pdf/source/20170918/C82942_1505727073070976520.pdf; Supplier: LCSC; Output Type: 固定; Voltage - Supply: 6V; Output Voltage: 3.3V; Output Current: 500mA; Power Supply Rejection Ratio (PSRR): 70dB@(1kHz)；62dB@(10kHz); Voltage Dropout: 260mV@(200mA); Features: 短路保护(SCP)；低ESR；过流保护(OCP)；带使能; Output Configuration: 正极; Number of Outputs: 1
R186 = 0402WGF1243TCE: LCSC Part Name: 124kΩ ±1% 62.5mW 厚膜电阻; Supplier Part: C36777; Manufacturer: UNI-ROYAL(厚声); Supplier Footprint: 0402; JLCPCB Part Class: Extended Part; Datasheet: https://item.szlcsc.com/datasheet/0402WGF1243TCE/37755.html; Supplier: LCSC; Type: 厚膜电阻; Tolerance: ±1%; Power(Watts): 62.5mW; Voltage-Supply(Max): 50V; Temperature Coefficient: ±100ppm/℃; Operating Temperature: -55℃~+155℃
R203 = HoLLR2512-3W-2mR-1%: LCSC Part Name: 2mΩ ±1% 3W; Supplier Part: C2994640; Manufacturer: Milliohm(毫欧); Supplier Footprint: 2512; JLCPCB Part Class: 扩展库; Datasheet: https://atta.szlcsc.com/upload/public/pdf/source/20220330/9E8D3880B1628B3B70C68092C8A7E08B.pdf; Supplier: LCSC; Type: 采样电阻; Tolerance: ±1%; Power(Watts): 3W; Rated Current: 77.5A; Temperature Coefficient: ±50ppm/℃; Mounting Sytle: 贴片
R230 = 0402WGF4702TCE: LCSC Part Name: 47kΩ ±1% 62.5mW 厚膜电阻; Supplier Part: C25792; Manufacturer: UNI-ROYAL(厚声); Supplier Footprint: 0402; JLCPCB Part Class: Basic Part; Datasheet: https://item.szlcsc.com/datasheet/0402WGF4702TCE/26535.html; Supplier: LCSC; Type: 厚膜电阻; Tolerance: ±1%; Power(Watts): 62.5mW; Voltage-Supply(Max): 50V; Temperature Coefficient: ±100ppm/℃; Operating Temperature: -55℃~+155℃
R231 = 0402WGF1002TCE: 电阻类型:厚膜电阻;阻值:10kΩ;精度:±1%;功率:62.5mW;工作电压:50V;温度系数:±100ppm/℃;; LCSC Part Name: 10kΩ ±1% 62.5mW 厚膜电阻; Supplier Part: C25744; Manufacturer: UNI-ROYAL(厚声); Supplier Footprint: 0402; JLCPCB Part Class: Basic Part; Datasheet: https://item.szlcsc.com/datasheet/0402WGF1002TCE/26487.html; Supplier: LCSC; Type: 厚膜电阻; Tolerance: ±1%; Power(Watts): 62.5mW; Overload Voltage (Max): 50V; Temperature Coefficient: ±100ppm/℃; Operating Temperature Range: -55℃~+155℃; Voltage-Supply(Max): 50V; Operating Temperature: -55℃~+155℃
R242 = RC0402FR-0723K7L: LCSC Part Name: 厚膜电阻 23.7kΩ ±1% 62.5mW; Supplier Part: C327362; Manufacturer: YAGEO(国巨); Supplier Footprint: 0402; JLCPCB Part Class: Extended Part; Datasheet: https://item.szlcsc.com/datasheet/RC0402FR-0723K7L/307456.html; Supplier: LCSC; Type: 厚膜电阻; Tolerance: ±1%; Power(Watts): 62.5mW; Voltage-Supply(Max): 50V; Temperature Coefficient: ±100ppm/℃; Operating Temperature: -55℃~+155℃
R243 = 0402WGF1202TCE: LCSC Part Name: 12kΩ ±1% 62.5mW 厚膜电阻; Supplier Part: C25752; Manufacturer: UNI-ROYAL(厚声); Supplier Footprint: 0402; JLCPCB Part Class: Basic Part; Datasheet: https://item.szlcsc.com/datasheet/0402WGF1202TCE/26495.html; Supplier: LCSC; Type: 厚膜电阻; Tolerance: ±1%; Power(Watts): 62.5mW; Voltage-Supply(Max): 50V; Temperature Coefficient: ±100ppm/℃; Operating Temperature: -55℃~+155℃
R244 = 0402WGF4701TCE: 电阻类型:厚膜电阻;阻值:4.7kΩ;精度:±1%;功率:62.5mW;工作电压:50V;温度系数:±100ppm/℃;; LCSC Part Name: 4.7kΩ ±1% 62.5mW 厚膜电阻; Supplier Part: C25900; Manufacturer: UNI-ROYAL(厚声); Supplier Footprint: 0402; JLCPCB Part Class: Basic Part; Datasheet: https://item.szlcsc.com/datasheet/0402WGF4701TCE/26643.html; Supplier: LCSC; Type: 厚膜电阻; Tolerance: ±1%; Power(Watts): 62.5mW; Overload Voltage (Max): 50V; Temperature Coefficient: ±100ppm/℃; Operating Temperature Range: -55℃~+155℃; Voltage-Supply(Max): 50V; Operating Temperature: -55℃~+155℃
U39 = BL9342: LCSC Part Name: 40V，600mA降压型稳压电路; Supplier Part: C93176; Manufacturer: BL(上海贝岭); Supplier Footprint: SOT-23-6; JLCPCB Part Class: 扩展库; Datasheet: https://item.szlcsc.com/datasheet/BL9342/94371.html; Supplier: LCSC; Function: 降压型; Voltage - Supply: 4.2V~40V; Output Current: 600mA; Frequency - Switching: 1.8MHz; Operating Temperature: -40℃~+125℃@(TJ); Synchronous Rectifier: 否; Number of Outputs: 1; Topology: 降压式; Quiescent Current: 200uA; Switch tube (built-in/external): 内置; Output Type: 可调
U41 = SMBJ18A_C19077573: LCSC Part Name: 单向TVS 18V截止 峰值浪涌电流：20.55A@10/1000us; Supplier Part: C19077573; Manufacturer: R+O(宏嘉诚); Supplier Footprint: DO-214AA(SMB); JLCPCB Part Class: 扩展库; Datasheet: https://item.szlcsc.com/datasheet/SMBJ18A/20275658.html; Supplier: LCSC; Polarity: 单向; Reverse Stand-Off Voltage (Vrwm): 18V; Clamping Voltage: 29.2V; Peak Pulse Current (Ipp): 20.55A@10/1000us; Peak Pulse Power Dissipation (Ppp): 600W@10/1000us; Voltage - Breakdown: 22.1V; Reverse Leakage Current (Ir): 5uA; Operating Temperature: -55℃~+150℃; level of protection: IEC 61000-4-2; Type: TVS
U43 = CJ78L12_C8615: LCSC Part Name: 输入35V 输出12V 100mA; Supplier Part: C8615; Manufacturer: CJ(江苏长电/长晶); Supplier Footprint: SOT-89-3L; JLCPCB Part Class: 扩展库; Datasheet: https://item.szlcsc.com/datasheet/CJ78L12/9110.html; Supplier: LCSC; Output Type: 固定; Voltage - Supply: 35V; Output Voltage: 12V; Output Current: 100mA; Power Supply Rejection Ratio (PSRR): 42dB@(120Hz); Voltage Dropout: 1.7V@(40mA); standby current: 4.3mA; Noise: 70uV; Operating Temperature: 0℃~+150℃@(Tj); Output Configuration: 正极; Number of Outputs: 1
C231 = 0402CG101J500NT: LCSC Part Name: 100pF ±5% 50V; Supplier Part: C1546; Manufacturer: FH(风华); Supplier Footprint: 0402; JLCPCB Part Class: Basic Part; Datasheet: https://atta.szlcsc.com/upload/public/pdf/source/20200305/C486355_26A10D38EF8C2A5C37091D0039909270.pdf; Supplier: LCSC; Tolerance: ±5%; Voltage Rated: 50V; Temperature Coefficient: C0G
R211 R215 R218 = 0402WGF5102TCE: LCSC Part Name: 51kΩ ±1% 62.5mW 厚膜电阻; Supplier Part: C25794; Manufacturer: UNI-ROYAL(厚声); Supplier Footprint: 0402; JLCPCB Part Class: Basic Part; Datasheet: https://atta.szlcsc.com/upload/public/pdf/source/20200306/C422600_1E6D84923E4A46A82E41ADD87F860B5C.pdf; Supplier: LCSC; Type: 厚膜电阻; Tolerance: ±1%; Power(Watts): 62.5mW; Overload Voltage (Max): 50V; Temperature Coefficient: ±100ppm/℃; Operating Temperature Range: -55℃~+155℃
R213 R217 R220 = FRC0402F3001TS: LCSC Part Name: 3kΩ ±1% 62.5mW 厚膜电阻; Supplier Part: C2909355; Manufacturer: FOJAN(富捷); Supplier Footprint: 0402; JLCPCB Part Class: Extended Part; Supplier: LCSC; Type: 厚膜电阻; Tolerance: ±1%; Power(Watts): 62.5mW; Voltage-Supply(Max): 50V; Temperature Coefficient: ±100ppm/℃; Operating Temperature: -55℃~+155℃
R214 R216 R219 = 0402WGF4302TCE: LCSC Part Name: 43kΩ ±1% 62.5mW 厚膜电阻; Supplier Part: C8329; Manufacturer: UNI-ROYAL(厚声); Supplier Footprint: 0402; JLCPCB Part Class: Extended Part; Datasheet: https://atta.szlcsc.com/upload/public/pdf/source/20200306/C422600_1E6D84923E4A46A82E41ADD87F860B5C.pdf; Supplier: LCSC; Type: 厚膜电阻; Tolerance: ±1%; Power(Watts): 62.5mW; Overload Voltage (Max): 50V; Temperature Coefficient: ±100ppm/℃; Operating Temperature Range: -55℃~+155℃
R225-R228 = RT0402BRD071K2L: LCSC Part Name: 薄膜电阻 1.2kΩ ±0.1% 63mW; Supplier Part: C852606; Manufacturer: YAGEO(国巨); Supplier Footprint: 0402; JLCPCB Part Class: 扩展库; Datasheet: https://item.szlcsc.com/datasheet/RT0402BRD071K2L/912928.html; Supplier: LCSC; Type: 薄膜电阻; Tolerance: ±0.1%; Power(Watts): 63mW; Voltage-Supply(Max): 50V; Temperature Coefficient: ±25ppm/℃; Operating Temperature: -55℃~+155℃
R229 = RT0402BRD0766K5L: LCSC Part Name: 薄膜电阻 66.5kΩ ±0.1% 62.5mW; Supplier Part: C852884; Manufacturer: YAGEO(国巨); Supplier Footprint: 0402; JLCPCB Part Class: 扩展库; Datasheet: https://item.szlcsc.com/datasheet/RT0402BRD0766K5L/913206.html; Supplier: LCSC; Type: 薄膜电阻; Tolerance: ±0.1%; Power(Watts): 62.5mW; Voltage-Supply(Max): 50V; Temperature Coefficient: ±25ppm/℃; Operating Temperature: -55℃~+155℃
R237 R238 = RT0402BRD07133KL: LCSC Part Name: 薄膜电阻 133kΩ ±0.1% 63mW; Supplier Part: C852517; Manufacturer: YAGEO(国巨); Supplier Footprint: 0402; JLCPCB Part Class: 扩展库; Datasheet: https://item.szlcsc.com/datasheet/RT0402BRD07133KL/912839.html; Supplier: LCSC; Type: 薄膜电阻; Tolerance: ±0.1%; Power(Watts): 63mW; Temperature Coefficient: ±25ppm/℃; Operating Temperature: -55℃~+155℃

## Nets
GND: ATLINK.3 C131.1 C211.1 C212.2 C213.1 C225.1 C226.1 C227.1 C228.1 C229.1 C230.1 C234.1 C235.1 C236.1 C237.2 DSHOT.2 L12.4 LDO1.2(VSS) R188.2 R213.2 R217.2 R220.2 R238.1 U34.33(EP) UART.3 X3.2(GND) X3.4(GND)
GND_IN: BUS_OUT.1 C205.2 C208.1 C210.1 C243.1 C244.1 C245.1 C246.1 C247.1 C248.1 L12.1 R203.2 R205.2 R231.2 R242.2 R244.2 U39.2(GND) U41.2(A)
GNDP: C214.2 C221.1 C238.2 C239.2 C240.2 C241.2 C249.1 C250.1 C251.1 C252.1 Q2.1(S) Q2.2(S) Q2.3(S) Q4.1(S) Q4.2(S) Q4.3(S) Q6.1(S) Q6.2(S) Q6.3(S) R203.1 R204.2 R206.1 U40.6(COM) U40.25(EP) U43.2(GND)
VBUS: BUS_IN.1 C205.1 C208.2 C221.2 C238.1 C239.1 C240.1 C245.2 C246.2 C247.2 C248.2 C249.2 C250.2 C251.2 C252.2 L15.1 Q1.5(D) Q3.5(D) Q5.5(D) R230.1 R243.1 U39.5(VIN) U41.1(C) U43.3(Vin)
VBUS_REF: R208.1 R230.2 R231.1
VCC_3V3: C236.2 L13.1 LDO1.5(VOUT)
VCC_5V: C210.2 C233.1 C243.2 C244.2 L11.2 L12.2 R186.1
VCC_12V: C241.1 L14.1 U43.1(Vout)
VDD_3V3: C131.2 C237.1 L13.2 R189.1 R190.1 R207.2 R237.1 U34.1(VDD/VDDA)
BOOT0: R188.1 U34.31(PF11/BOOT0)
COM_NUTRAL: R211.1 R215.1 R218.1 R224.1
EMF1: R211.2 R213.1 R214.1 R221.1
EMF2: R215.2 R216.1 R217.1 R222.1
EMF3: R218.2 R219.1 R220.1 R223.1
EMF_NUTRAL: C230.2 R224.2 U34.13(PA7)
EMF_U: C227.2 R221.2 U34.10(PA4)
EMF_V: C228.2 R222.2 U34.11(PA5)
EMF_W: C229.2 R223.2 U34.12(PA6)
FB: C233.2 R186.2 R242.1 U39.3(FB)
HO1: D40.1(K) R191.1 U40.19(HO1)
HO2: D41.1(K) R193.1 U40.16(HO2)
HO3: D42.1(K) R195.1 U40.13(HO3)
I_BUS_GND: C220.2 R205.1 R226.1
I_BUS_SHUNT: C220.1 R204.1 R225.1
LED_G: LED1.1(R-) U34.17(PB10)
LED_R: LED1.3(UG-) U34.7(PA1)
LO1: D43.1(K) R192.1 U40.11(LO1)
LO2: D44.1(K) R194.1 U40.10(LO2)
LO3: D45.1(K) R196.1 U40.9(LO3)
MOS_NTC: R206.2 R207.1 R209.1
MOS_TEMP: C226.2 R209.2 U34.5(PF9)
NRST: C211.2 U34.4(NRST/PF2)
OP3_INM_BUS: R228.2 R229.1 U34.16(PB2)
OP3_INP_BUS: R227.2 R237.2 R238.2 U34.14(PB0)
OP3_OUT_BUS: R229.2 U34.15(PB1)
OSC_IN: C212.1 U34.2(PF0) X3.1(OSC1)
OSC_OUT: C213.2 U34.3(PF1) X3.3(OSC2)
OUT1: C215.1 Q1.1(S) Q1.2(S) Q1.3(S) Q2.5(D) R214.2 R239.1 U.1 U40.18(VS1)
OUT2: C217.1 Q3.1(S) Q3.2(S) Q3.3(S) Q4.5(D) R216.2 R240.1 U40.15(VS2) V.1
OUT3: C219.1 Q5.1(S) Q5.2(S) Q5.3(S) Q6.5(D) R219.2 R241.1 U40.12(VS3) W.1
PWM_IN_DSHOT: DSHOT.1 U34.32(PB8)
SWCLK: ATLINK.2 U34.24(PA14)
SWDIO: ATLINK.1 U34.23(PA13)
TIM1_CH1: R197.1 U34.18(PA8)
TIM1_CH1N: R198.1 U34.30(PB7)
TIM1_CH2: R199.1 U34.19(PA9)
TIM1_CH2N: R200.1 U34.22(PA12)
TIM1_CH3: R201.1 U34.20(PA10)
TIM1_CH3N: R202.1 U34.29(PB6)
UART_RX: U34.9(PA3) UART.2
UART_TX: U34.8(PA2) UART.1
V_BUS_FB: C225.2 R208.2 U34.6(PA0)
VB1: C215.2 D37.1(K) U40.20(VB1)
VB2: C217.2 D38.1(K) U40.17(VB2)
VB3: C219.2 D39.1(K) U40.14(VB3)
VBOOST: C214.1 D37.2(A) D38.2(A) D39.2(A) L14.2 L15.2 U40.4(VCC)
$1N15952: R243.2 R244.1 U39.4(EN)
$1N16158: C232.2 U39.1(BST)
$1N16164: C232.1 L11.1 U39.6(SW)
$1N16703: C234.2 C235.2 L12.3 LDO1.1(VIN) LDO1.3(CE)
$2N17344: PA11.1 U34.21(PA11)
$2N17781: PA15.1 U34.25(PA15)
$2N18473: LED1.4(+UG) R189.2
$2N18489: LED1.2(+R) R190.2
$2N29618: PB5.1 U34.28(PB5)
$2N29622: PB4.1 U34.27(PB4)
$2N29627: PB3.1 U34.26(PB3)
$9N2585: R197.2 U40.22(HIN1)
$9N2628: R198.2 U40.1(LIN1)
$9N2671: R199.2 U40.23(HIN2)
$9N2714: R200.2 U40.2(LIN2)
$9N2757: R201.2 U40.24(HIN3)
$9N2800: R202.2 U40.3(LIN3)
$9N19403: D41.2(A) Q3.4(G) R193.2 R240.2
$9N19423: D42.2(A) Q5.4(G) R195.2 R241.2
$9N19478: D43.2(A) Q2.4(G) R192.2
$9N19572: D45.2(A) Q6.4(G) R196.2
$9N19590: D44.2(A) Q4.4(G) R194.2
$9N21132: D40.2(A) Q1.4(G) R191.2 R239.2
$10N1086: C231.1 R226.2 R228.1
$10N1091: C231.2 R225.2 R227.1

Not connected (* = marked no-connect by the designer): LDO1 4(NC)*; U40 5(NC)* 7(NC)* 8(NC)* 21(NC)*

## Notes on the sheets
sheet 1
- 12.8~16.8V
- 5V 0.6A
- 3V3 0.5A
